# Altium schematic sheet 1_Triangle Wave Generator.SchDoc
size A4; SheetNumber: 6; SheetTotal: 6
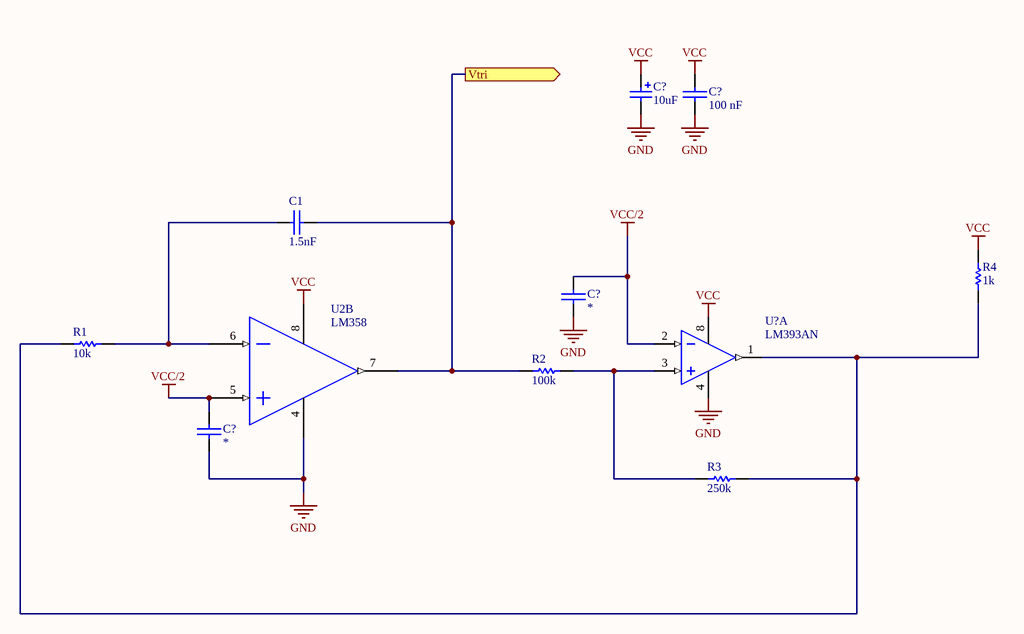
[diagram p0: 1_Triangle Wave Generator.SchDoc]

## Parts
(Parts that share a designator on the sheet are numbered #1, #2 ... from top to bottom, then left to right.)
C1  1.5nF  [ece-RAD0.2]
C?#1  10uF  [ece-CAPAD2TH0.3]
C?#2  100 nF  [ece-RAD0.2]
C?#3  *  [ece-RAD0.2]
C?#4  *  [ece-RAD0.2]
R1  10k  [ece-AXIAL0.4]
R2  100k  [ece-AXIAL0.4]
R3  250k  [ece-AXIAL0.4]
R4  1k  [ece-AXIAL0.4]
U2  LM358  [ECE-DIP8]  (part B of 2)
U?  LM393AN  [ECE-DIP8]  (part A of 2)

## Ports
Vtri (out)

## Nets
GND: C?#1.2 C?#2.2 C?#3.1 C?#4.1 U2.4(GND) U?.4(GND)
VCC: C?#1.1 C?#2.1 R4.2 U2.8(V(+)) U?.8(V+)
VCC/2: C?#3.2 C?#4.2 U2.5(IN2(+)) U?.2(IN-)
Vtri: C1.2 R2.1 U2.7(OUT2) ; port Vtri
NetC1_1: C1.1 R1.2 U2.6(IN2(-))
NetR1_1: R1.1 R3.2 R4.1 U?.1(OUT)
NetR2_2: R2.2 R3.1 U?.3(IN+)

## Library data of the parts
C1 C?#2-C?#4 = CAP: Capacitor Non Polarised Through Hole
  C1 C?#3 C?#4: Value: *
  C?#2: Value: 100 nF
C?#1 = CAP 22uF TH: Polarized Capacitor (Radial); Manufacturer: Generic Components; Class I: Passive; Published: 8-Jun-2000; Revision: July-2002: Re-released for DXP Platform.; Publisher: Altium Limited; Class II: Capacitor; Value: 10uF
R1-R4 = Res1: Resistor; Published: 8-Jun-2000; LatestRevisionDate: 17-Jul-2002; LatestRevisionNote: Re-released for DXP Platform.; PackageReference: AXIAL-0.3; Publisher: Altium Limited; Value: *
U2 = TLC082
U? = LM393AN: Dual Comparator; Published: 17-Jul-2002; LatestRevisionDate: 06-Jun-2005; LatestRevisionNote: Stylized 3D Model Added.; DatasheetVersion: 1988; PackageReference: 626-05; Publisher: Altium Limited; PackageDescription: DIP; 8 Leads; Row Spacing 7.62 mm; Pitch 2.54 mm; ComponentLink1Description: Manufacturer Link; ComponentLink1URL: http://www.onsemi.com/site/products/taxonomy/0,4438,133,00.html